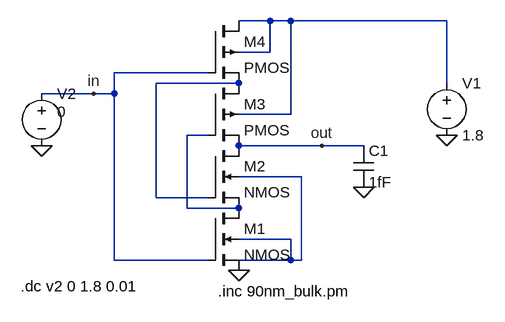
[diagram p0: schematic LCT.asc]
LCT.asc, the LTspice schematic file:
Version 4
SHEET 1 880 680
WIRE 240 -48 192 -48
WIRE 272 -48 240 -48
WIRE 512 -48 272 -48
WIRE 240 0 240 -48
WIRE 240 0 192 0
WIRE 144 32 0 32
WIRE 192 48 64 48
WIRE 512 48 512 -48
WIRE -32 64 -112 64
WIRE 0 64 0 32
WIRE 0 64 -32 64
WIRE 272 96 272 -48
WIRE 272 96 192 96
WIRE 144 128 112 128
WIRE 320 144 192 144
WIRE 384 144 320 144
WIRE 288 192 192 192
WIRE 64 224 64 48
WIRE 144 224 64 224
WIRE 112 240 112 128
WIRE 192 240 112 240
WIRE 272 288 192 288
WIRE 0 320 0 64
WIRE 144 320 0 320
WIRE 272 320 272 288
WIRE 272 320 192 320
WIRE 288 320 288 192
WIRE 288 320 272 320
FLAG -112 144 0
FLAG 192 336 0
FLAG 512 128 0
FLAG 384 208 0
FLAG -32 64 in
FLAG 320 144 out
SYMBOL nmos4 144 240 R0
SYMATTR InstName M1
SYMATTR Value2 l=100n w=120n
SYMBOL nmos4 144 144 R0
SYMATTR InstName M2
SYMATTR Value2 l=100n w=120n
SYMBOL pmos4 144 48 R0
SYMATTR InstName M3
SYMATTR Value2 l=100n w=400n
SYMBOL pmos4 144 -48 R0
SYMATTR InstName M4
SYMATTR Value2 l=100n w=400n
SYMBOL voltage 512 32 R0
WINDOW 123 0 0 Left 0
WINDOW 39 0 0 Left 0
SYMATTR InstName V1
SYMATTR Value 1.8
SYMBOL voltage -112 48 R0
WINDOW 123 0 0 Left 0
WINDOW 39 0 0 Left 0
WINDOW 3 24 44 Left 2
SYMATTR Value 0
SYMATTR InstName V2
SYMBOL cap 368 144 R0
SYMATTR InstName C1
SYMATTR Value 1fF
TEXT -144 360 Left 2 !.dc v2 0 1.8 0.01
TEXT 160 368 Left 2 !.inc 90nm_bulk.pm

The netlist it stands for:
* LCT.asc
M1 N003 in 0 N004 NMOS l=100n w=120n
M2 out N002 N003 N004 NMOS l=100n w=120n
M3 N002 N003 out N001 PMOS l=100n w=400n
M4 N001 in N002 N001 PMOS l=100n w=400n
V1 N001 0 1.8
V2 in 0 0
C1 out 0 1fF
.model NMOS NMOS
.model PMOS PMOS
.lib standard.mos
.dc v2 0 1.8 0.01
.inc 90nm_bulk.pm
.backanno
.end